# Altium schematic sheet CATS-FAT-PM.SchDoc: CATS Pro
size A4; Author: Luca Jost; Revision: 1.0; SheetNumber: 4; SheetTotal: 13; Subtitle: Power Management
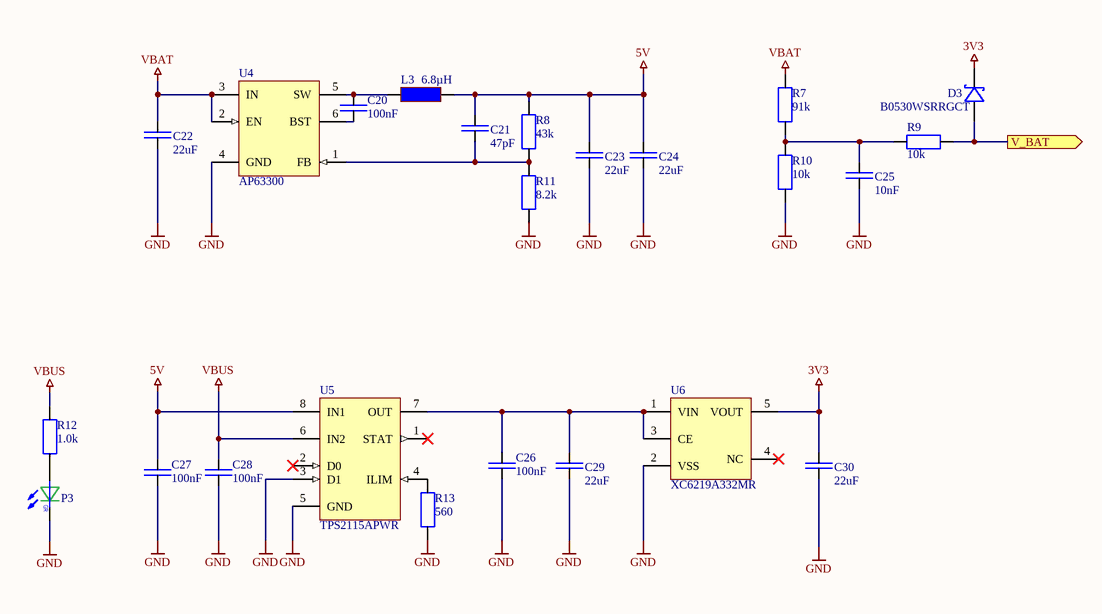
[diagram p0: CATS-FAT-PM.SchDoc]

## Parts
C20  100nF  [SMD Keramikkondensator 0603]
C21  47pF  [SMD Keramikkondensator 0603]
C22  22uF  [SMD Keramikkondensator 0805]
C23  22uF  [SMD Keramikkondensator 0805]
C24  22uF  [SMD Keramikkondensator 0805]
C25  10nF  [SMD Keramikkondensator 0603]
C26  100nF  [SMD Keramikkondensator 0603]
C27  100nF  [SMD Keramikkondensator 0603]
C28  100nF  [SMD Keramikkondensator 0603]
C29  22uF  [SMD Keramikkondensator 0805]
C30  22uF  [SMD Keramikkondensator 0805]
D3  B0530WSRRGCT  [SMD Diode SOD-323F]
L3  6.8µH  [SMD Inductor 8x8]
P3  LED  [SMD LED 0603]  (value not drawn)
R7  91k  [SMD Widerstand 0603]
R8  43k  [SMD Widerstand 0603]
R9  10k  [SMD Widerstand 0603]
R10  10k  [SMD Widerstand 0603]
R11  8.2k  [SMD Widerstand 0603]
R12  1.0k  [SMD Widerstand 0603]
R13  560  [SMD Widerstand 0603]
U4  AP63300  [SMD IC TSOT-23-6]
U5  TPS2115APWR  [SMD IC TSSOP-8]
U6  XC6219A332MR  [SMD IC SOT-23-5]

## Ports
V_BAT (out)

## Nets
3V3: C30.2 D3.K U6.5(VOUT)
5V: C21.2 C23.2 C24.2 C27.2 L3.2 R8.2 U5.8(IN1)
GND: C22.1 C23.1 C24.1 C25.1 C26.1 C27.1 C28.1 C29.1 C30.1 P3.K R10.1 R11.1 R13.1 U4.4(GND) U5.3(D1) U5.5(GND) U6.2(VSS)
VBAT: C22.2 R7.2 U4.2(EN) U4.3(IN)
VBUS: C28.2 R12.2 U5.6(IN2)
V_BAT: D3.A R9.1 ; port V_BAT
NetC20_1: C20.1 U4.6(BST)
NetC20_2: C20.2 L3.1 U4.5(SW)
NetC21_1: C21.1 R8.1 R11.2 U4.1(FB)
NetC25_2: C25.2 R7.1 R9.2 R10.2
NetC26_2: C26.2 C29.2 U5.7(OUT) U6.1(VIN) U6.3(CE)
NetP3_A: P3.A R12.1
NetR13_2: R13.2 U5.4(ILIM)

Not connected (* = marked no-connect by the designer): U5 1(STAT)* 2(D0)*; U6 4(NC)*

## Notes on the sheet
- Title
- Author:
- Subtitle
- Date:
- Rev:
- CATS
- Sheet
- of
- File:
- (in symbol LED) GR

## Library data of the parts
C20 C26-C28 = E6 - 100nF: SMD Ceramic Capacitor E6; Unit Price: 0.01; Number: -; Supplier: -
C21 = E6 - 47pF: SMD Ceramic Capacitor E6; Unit Price: 0.01; Number: -; Supplier: -
C22-C24 C29 C30 = E6 - 22uF: SMD Ceramic Capacitor E6; Unit Price: 0.01; Number: -; Supplier: -
C25 = E6 - 10nF: SMD Ceramic Capacitor E6; Unit Price: 0.01; Number: -; Supplier: -
D3 = B0530WSRRGCT: 200mW, 0.47V Schottky Barrier Diode; Digikey: B0530WSRRGCT-ND; ComponentLink1Description: Datasheet; ComponentLink1URL: https://www.taiwansemi.com/products/datasheet/B0530WS_J1709.pdf
L3 = Inductor 6.8µH / 5A: FIXED IND 6.8UH 5A 25MOHM SMD; Digikey: SRN8040TA-6R8MTR-ND
P3 = LED: Color LED
R7 = E24 - 91k: SMD Chip Resistor E24; Unit Price: 0.01; Number: -; Supplier: -
R8 = E24 - 43k: SMD Chip Resistor E24; Unit Price: 0.01; Number: -; Supplier: -
R9 R10 = E24 - 10k: SMD Chip Resistor E24; Unit Price: 0.01; Number: -; Supplier: -
R11 = E24 - 8.2k: SMD Chip Resistor E24; Unit Price: 0.01; Number: -; Supplier: -
R12 = E24 - 1.0k: SMD Chip Resistor E24; Unit Price: 0.01; Number: -; Supplier: -
R13 = E24 - 560: SMD Chip Resistor E24; Unit Price: 0.01; Number: -; Supplier: -
U4 = AP63300: 3.8V TO 32V INPUT, 3A LOW IQ SYNCHRONOUS BUCK WITH ENHANCED EMI REDUCTION; ComponentLink1Description: Datasheet; ComponentLink1URL: https://www.diodes.com/assets/Datasheets/AP63300-AP63301.pdf; Digikey: 31-AP63300WU-7TR-ND
U5 = TPS2115APWR: Autoswitching Power MUX 1.25A; Item Description: Source Selector; Digikey: 296-16940-1-ND; Value: TPS2115A; Price: 2.41; ComponentLink1Description: Datasheet; ComponentLink1URL: http://www.ti.com/lit/ds/symlink/tps2115a.pdf
U6 = XC6219A332MR: 300mA High Speed LDO Regulators with ON/OFF Switch; Digikey: 893-1167-1-ND; ComponentLink1Description: Datasheet; ComponentLink1URL: https://datasheet.lcsc.com/szlcsc/1809201520_Torex-Semicon-XC6219A332MR_C58229.pdf